# Altium project dzsx1.PrjPCB
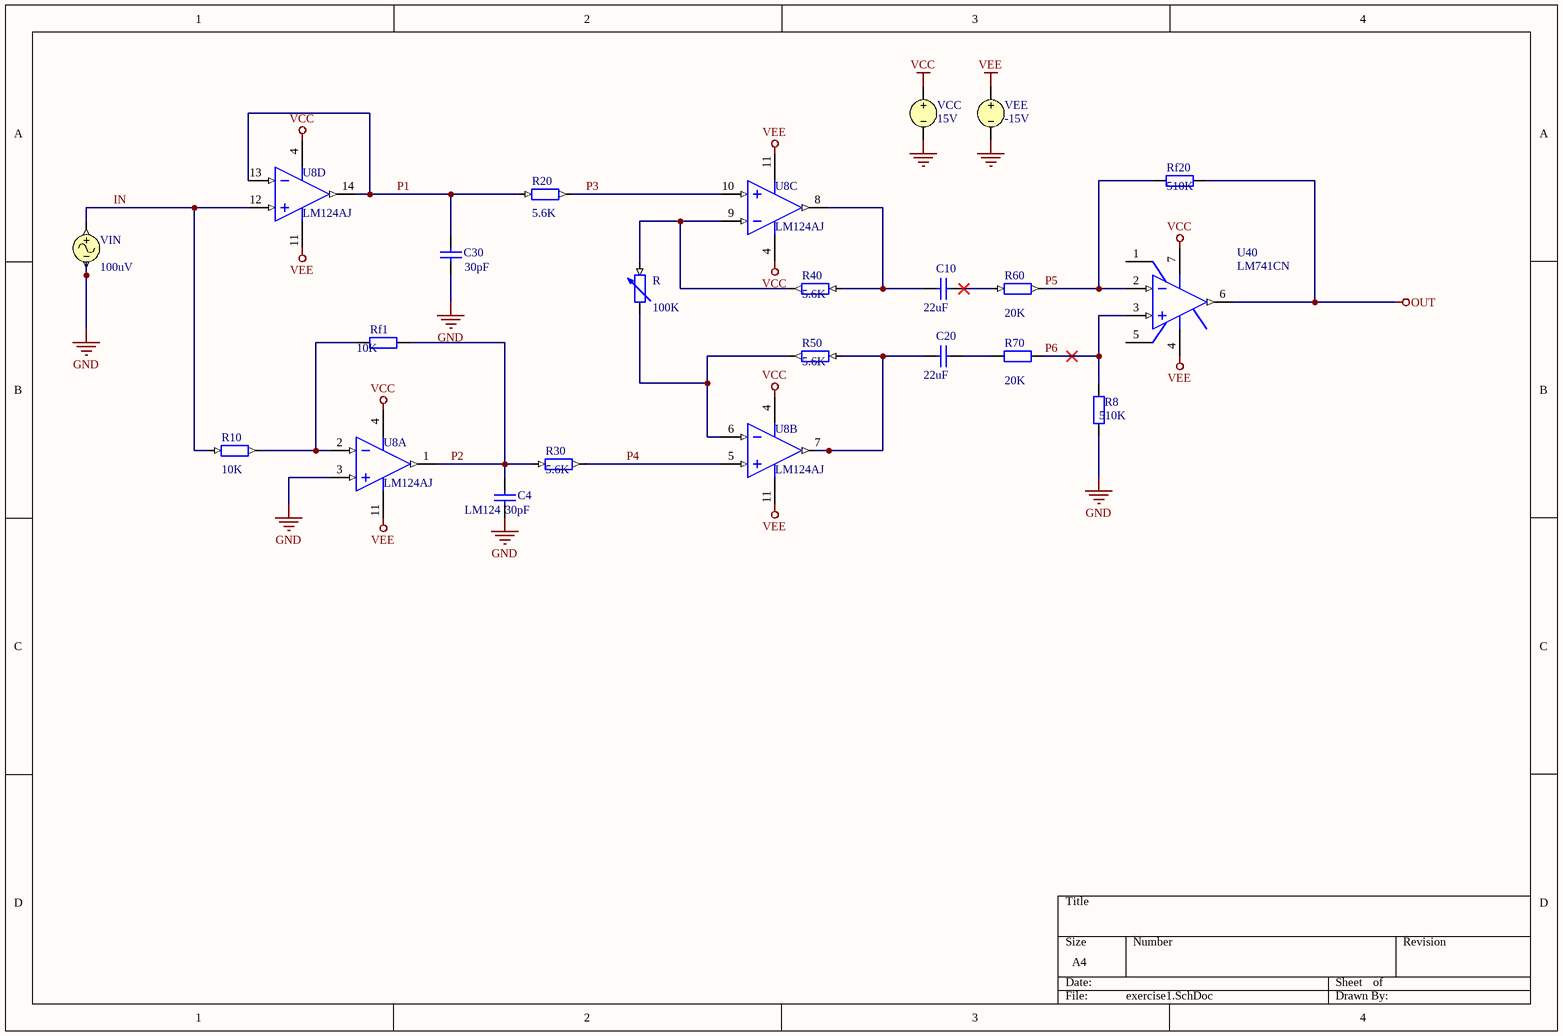
[diagram p0: exercise1.SchDoc]
1 sheet, 20 parts. Net scope: global (net labels, ports and power ports of the same name join across sheets).

## Sheet exercise1.SchDoc
size A4

### Parts
100uV  VIN
C4  LM124  value 30pF  [RAD-0.3]
C10  value 22uF  [RAD-0.3]  (hidden comment: Cap)
C20  value 22uF  [RAD-0.3]  (hidden comment: Cap)
C30  value 30pF  [RAD-0.3]
R  value 100K  [AXIAL-0.6]  (hidden comment: Res Adj2)
R8  value 510K  [AXIAL-0.4]  (hidden comment: Res2)
R10  value 10K  [AXIAL-0.4]  (hidden comment: Res2)
R20  value 5.6K  [AXIAL-0.4]  (hidden comment: Res2)
R30  value 5.6K  [AXIAL-0.4]  (hidden comment: Res2)
R40  value 5.6K  [AXIAL-0.4]  (hidden comment: Res2)
R50  value 5.6K  [AXIAL-0.4]  (hidden comment: Res2)
R60  value 20K  [AXIAL-0.4]  (hidden comment: Res2)
R70  value 20K  [AXIAL-0.4]  (hidden comment: Res2)
Rf1  value 10K  [AXIAL-0.4]  (hidden comment: Res2)
Rf20  value 510K  [AXIAL-0.4]  (hidden comment: Res2)
U8  LM124AJ  [J14A]  (parts A,B,C,D of 4)
U40  LM741CN  [N08E]
VCC  15V
VEE  -15V

### Nets
GND: 100uV.2 C4.1 C30.1 R8.1 U8.3(IN1+) VCC.2 VEE.2
OUT: Rf20.2 U40.6(OUT)
VCC: U8.4(V+) U40.7(V+) VCC.1
VEE: U8.11(GND) U40.4(V-) VEE.1
IN: 100uV.1 R10.1 U8.12(IN4+)
P1: C30.2 R20.1 U8.13(IN4-) U8.14(OUT4)
P2: C4.2 R30.1 Rf1.2 U8.1(OUT1)
P3: R20.2 U8.10(IN3+)
P4: R30.2 U8.5(IN2+)
P5: R60.2 Rf20.1 U40.2(IN-)
P6: R8.2 R70.2 U40.3(IN+)
NetC10_1: C10.1 R40.2 U8.8(OUT3)
NetC10_2: C10.2 R60.1
NetC20_1: C20.1 R50.2 U8.7(OUT2)
NetC20_2: C20.2 R70.1
NetR10_2: R10.2 Rf1.1 U8.2(IN1-)
NetR_1: R.1 R50.1 U8.6(IN2-)
NetR_2: R.2 R40.1 U8.9(IN3-)

Not connected (* = marked no-connect by the designer): U40 1(OFS_NULL) 5(OFS_NULL) 8(NC)

### Library data of the parts
100uV = VSIN: Sinusoidal Voltage Source; Note: PCB Footprint - Not required; Published: 8-Jun-2000; LatestRevisionDate: 15-Nov-2004; LatestRevisionNote: Corrected Netlist.; PackageReference: Not Applicable; Publisher: Altium Limited
C4 C10 C20 C30 = Cap: Capacitor; Published: 8-Jun-2000; LatestRevisionDate: 17-Jul-2002; LatestRevisionNote: Re-released for DXP Platform.; PackageReference: RAD-0.3; Publisher: Altium Limited; PackageDescription: Radial Cap, Thru-Hole; 2 Leads; 0.3 in Pin Spacing
R = Res Adj2: Variable Resistor; Set Position: 0.5; Published: 8-Jun-2000; LatestRevisionDate: 17-Jul-2002; LatestRevisionNote: Re-released for DXP Platform.; PackageReference: AXIAL-0.6; Publisher: Altium Limited; PackageDescription: Axial Device, Thru-Hole; 2 Leads; 0.6 in Pin Spacing
R8 R10 R20 R30 R40 R50 R60 R70 Rf1 Rf20 = Res2: Resistor; Published: 8-Jun-2000; LatestRevisionDate: 17-Jul-2002; LatestRevisionNote: Re-released for DXP Platform.; PackageReference: AXIAL-0.4; Publisher: Altium Limited; PackageDescription: Axial Device, Thru-Hole; 2 Leads; 0.4 in Pin Spacing
U8 = LM124AJ: Low Power Quad Operational Amplifier, 14-pin CerDIP; Manufacturer: National Semiconductor; PackageTopMarking: NSUZXYYTT*LM124AJ; PowerWise: N; CompType: Amplifiers; High-Reliability: Y; Published: 4-Dec-2008; LatestRevisionDate: 13-Jan-2009; LatestRevisionNote: Sim Model Added.; DatasheetVersion: Aug-2000; PackageVersion: revJ, Jul-2002; PackageReference: J14A; Publisher: Altium Limited; PackageDescription: Cerdip, .400 x .310in Body, 14 Lead, .300in Centers, .100in Pitch; Supplier 1: Digi-Key; Supplier Part Number 1: LM124AJ-ND; Supplier 2: Farnell; Supplier Part Number 2: 1416362; PartNumber: LM124AJ; RoHS: N; PinCount: 14; ComponentLink1Description: LM124A Datasheet; ComponentLink1URL: http://www.national.com/ds/LM/LM124.pdf; ComponentLink2Description: LM124A Web Page; ComponentLink2URL: http://www.national.com/pf/LM/LM124A.html; ComponentLink3Description: J14A Package Page; ComponentLink3URL: http://www.national.com/packaging/folders/j14a.html
U40 = LM741CN: Operational Amplifier, 8-pin MDIP; Manufacturer: National Semiconductor; PackageTopMarking: NSUZXYTTE#*LM*741CN; PowerWise: N; CompType: Amplifiers; Published: 4-Dec-2008; LatestRevisionDate: 13-Jan-2009; LatestRevisionNote: Sim Model Added.; DatasheetVersion: Aug-2000; PackageVersion: revG, May-2006; PackageReference: N08E; Publisher: Altium Limited; PackageDescription: MDIP, .365 x .250 x .130in, 8 Lead, .100in Pitch; Supplier 1: Farnell; Supplier Part Number 1: 1523833; Supplier 2: Farnell; Supplier Part Number 2: 9486780; PartNumber: LM741CN; RoHS: N; PinCount: 8; Code_JEDEC: MS-001-BA; ComponentLink1Description: LM741 Datasheet; ComponentLink1URL: http://www.national.com/ds/LM/LM741.pdf; ComponentLink2Description: LM741 Web Page; ComponentLink2URL: http://www.national.com/pf/LM/LM741.html; ComponentLink3Description: N08E Package Page; ComponentLink3URL: http://www.national.com/packaging/folders/n08e.html
VCC VEE = VSRC: Voltage Source; Note: PCB Footprint - Not required; Published: 8-Jun-2000; LatestRevisionDate: 17-Jul-2002; LatestRevisionNote: Re-released for DXP Platform.; PackageReference: Not Applicable; Publisher: Altium Limited
  VCC: Value: 15V
  VEE: Value: -15V